# EAGLE design boombox_power_high_amp (EAGLE 6.0)
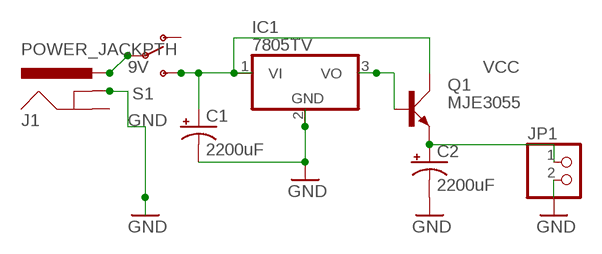
[diagram p0: schematic, sheet 1]

## Parts
C1  2200uF  CAP_POLPTH4  [CPOL-RADIAL-1000UF-25V]
C2  2200uF  CAP_POLPTH4  [CPOL-RADIAL-1000UF-25V]
IC1  7805TV  [TO220V]
J1  POWER_JACKPTH  [POWER_JACK_PTH]
JP1  PINHD-1X2  [1X02]
Q1  MJE3055  [TO220AV]
S1  SWITCH-SPSTPTH  [SWITCH-SPDT]

## Nets
9V: C1.1(+) IC1.1(VI) Q1.C S1.3(S)
GND: C1.2(-) C2.2(-) IC1.2(GND) J1.GNDBREAK JP1.2
N$1: J1.PWR S1.2(P)
N$2: C2.1(+) JP1.1 Q1.E
VCC: IC1.3(VO) Q1.B
Unconnected: J1.GND S1.1(O)

## Library data of the parts
C1 C2 = SparkFun:CAP_POL: Capacitor Polarized These are standard SMD and PTH capacitors. Normally 10uF, 47uF, and 100uF in electrolytic and tantalum varieties. Always verify the external diameter of the through hole cap, it varies with capacity, voltage, and manufacturer. The EIA devices should be standard.
IC1 = linear:78*: Positive VOLTAGE REGULATOR Source: http://cache.national.com/ds/LM/LM78L05.pdf http://www.fairchildsemi.com/ds/LM/LM7805.pdf
J1 = SparkFun:POWER_JACK: Power Jack This is the standard 5.5mm barrel jack for power. The PTH is the most common, proven, reliable, footprint. All others are experimental. The Slot footprint only works if the mill layer is transmitted to the PCB fab house so be warned. Spark Fun Electronics SKU : PRT-00119. Mating wall wart : TOL-00298 (and others)
JP1 = pinhead:PINHD-1X2: PIN HEADER
Q1 = transistor-power:MJE3055: NPN TRANSISTOR
S1 = SparkFun:SWITCH-SPST: SPST Switch Simple slide switch. Spark Fun Electronics SKU : COM-00102

## Board
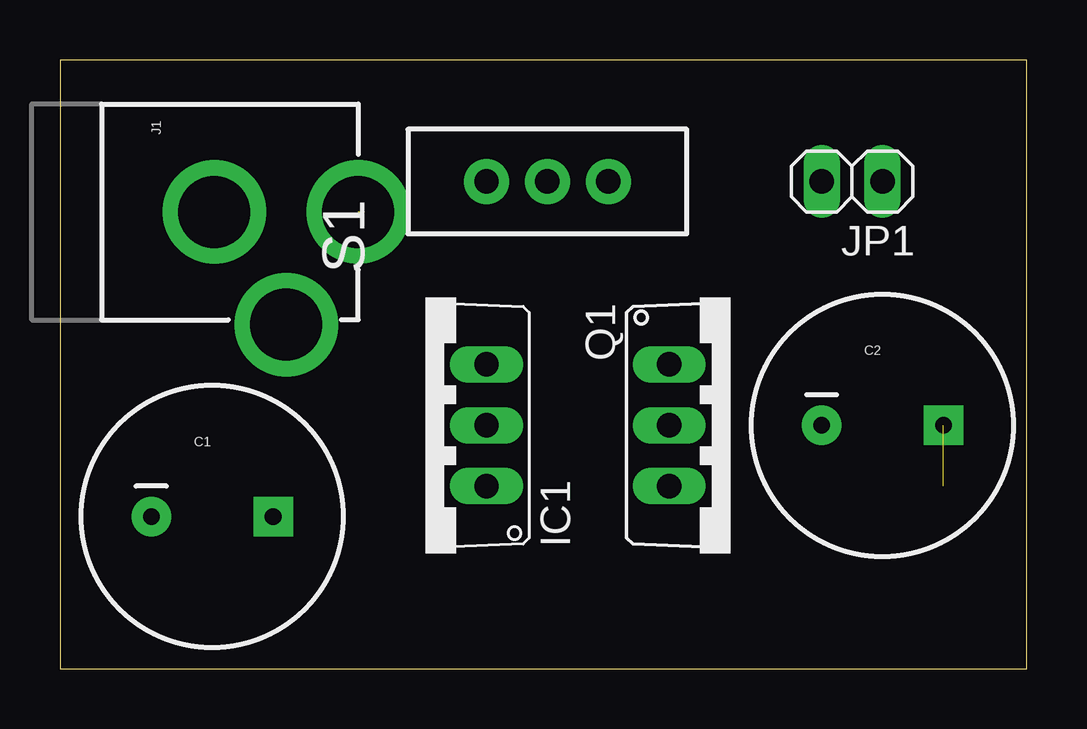
[diagram p1: board, top side]
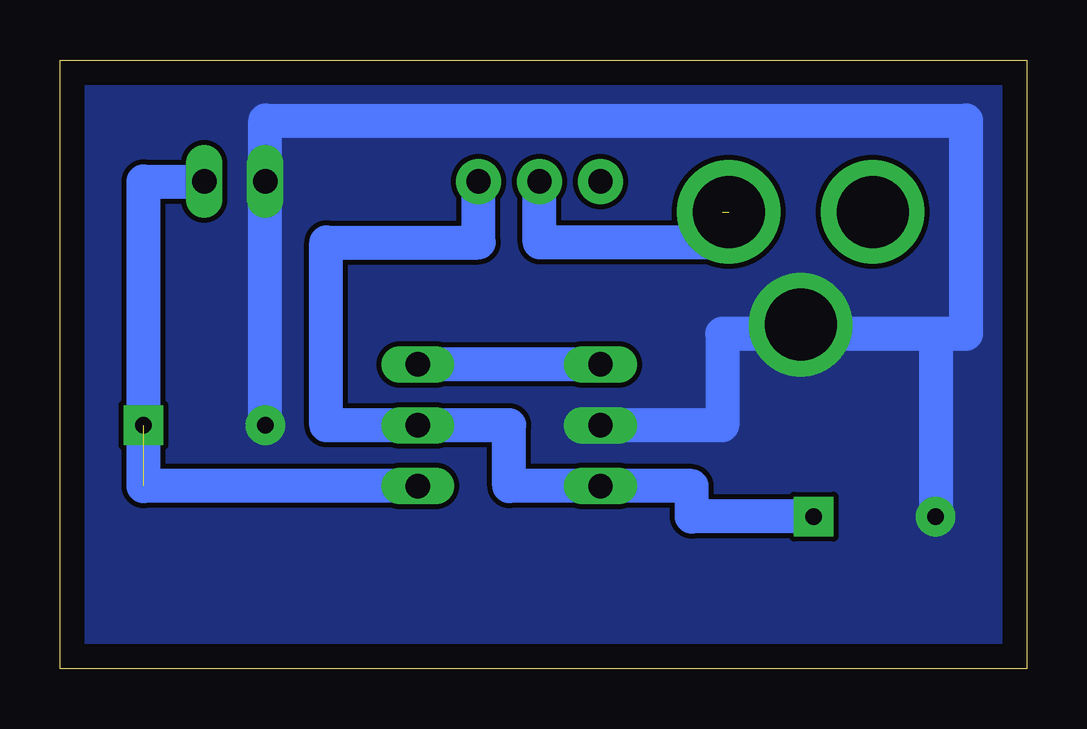
[diagram p2: board, bottom side, seen from below]

Size 40.31 x 25.39 mm. Coordinates in mm from the lower left corner, seen from the top.
Outline: 0,0 40.31,0 40.31,25.39 0,25.39 0,0
Copper layers (1*16): Top 0.035mm / dielectric 1.5mm / Bottom 0.035mm
Design rules: minimum track width 10mil, minimum drill 24mil, track to track 8mil, track to pad 8mil, pad to pad 8mil, via to via 8mil, smd to smd 8mil, copper to edge 40mil, drill to drill 8mil, minimum pad ring 10mil, minimum via ring 8mil, stop-mask expansion 4mil, vias tented up to drill 0mil, thermal gap 10mil

### Footprints (pad centres in the part's own frame; a part is rotated, then mirrored left to right if it is on the bottom)
CPOL-RADIAL-1000UF-25V = drill 0.7 pad 1.651 square: 1 2.54,0 | drill 0.7 pad 1.651: 2 -2.54,0
TO220V = drill 1.016 long: 1 -2.54,-2.54; 2 0,-2.54; 3 2.54,-2.54
POWER_JACK_PTH = drill 2.997 pad 4.318: GND 0,7.7; GNDBREAK 4.7,10.7; PWR 0,13.7
1X02 = drill 1.016 long: 1 -1.27,0; 2 1.27,0
TO220AV = drill 1.016 long: B -2.54,-2.54; C 0,-2.54; E 2.54,-2.54
SWITCH-SPDT = drill 1.016 pad 1.88: 1 0,2.54; 2 0,0; 3 0,-2.54

### Placement (x,y rotation side)
C1  6.35,6.35 0 top
C2  34.29,10.16 0 top
IC1  15.24,10.16 90 top
J1  -1.27,19.05 270 top
JP1  33.02,20.32 180 top
Q1  27.94,10.16 270 top
S1  20.32,20.32 90 top

### Tracks (layer width: path | path; a pad name or v marks a point on that pad's centre or on a via)
9V
  Bottom 1.422: C1.1 13.97,6.35 13.97,7.62 IC1.1 21.59,7.62 21.59,10.16 Q1.C 29.21,10.16 29.21,17.78 22.86,17.78 S1.3
GND
  Bottom 1.422: 3.81,13.97 C1.2 | 3.81,13.97 12.7,13.97 12.7,10.16 IC1.2 | C2.2 JP1.2 31.75,22.86 2.54,22.86 2.54,13.97 3.81,13.97
  pour Bottom (no thermals): 0,25.4 39.37,25.4 39.37,22.86 39.37,0 0,0
N$1  (1 unrouted)
  Bottom 1.422: 12.7,19.05 12.7,17.78 20.32,17.78 S1.2
N$2  (1 unrouted)
  Bottom 1.422: Q1.E 36.83,7.62 36.83,20.32 JP1.1
VCC
  Bottom 1.422: IC1.3 Q1.B